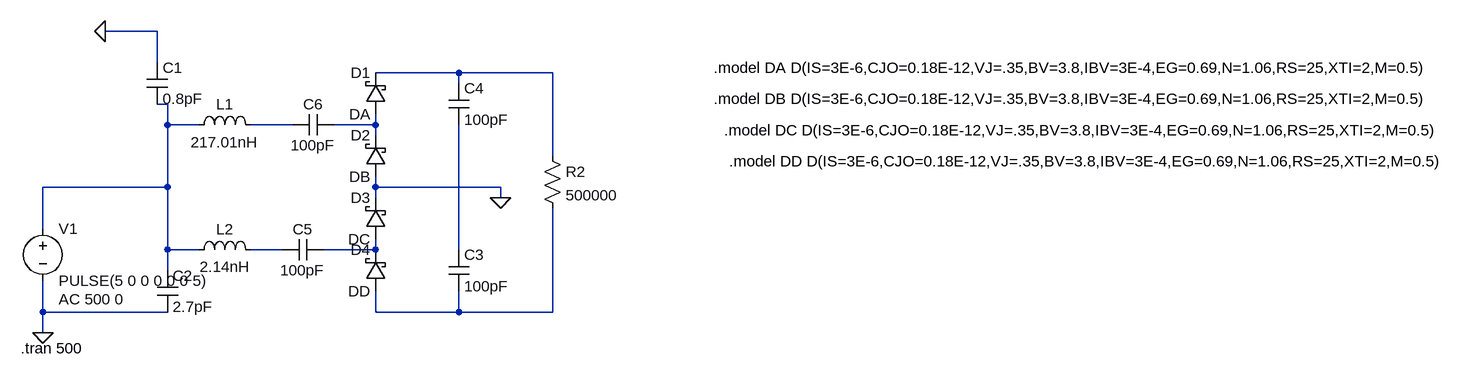
[diagram p0: schematic group 37 sim.asc]
group 37 sim.asc, the LTspice schematic file:
Version 4
SHEET 1 2120 680
WIRE -16 -32 -96 -32
WIRE -16 16 -16 -32
WIRE 448 32 320 32
WIRE 592 32 448 32
WIRE 448 48 448 32
WIRE 0 80 -16 80
WIRE 0 112 0 80
WIRE 48 112 0 112
WIRE 192 112 128 112
WIRE 320 112 320 96
WIRE 320 112 256 112
WIRE 320 128 320 112
WIRE 592 160 592 32
WIRE 0 208 0 112
WIRE 0 208 -192 208
WIRE 320 208 320 192
WIRE 512 208 320 208
WIRE 320 224 320 208
WIRE 512 224 512 208
WIRE -192 272 -192 208
WIRE 0 304 0 208
WIRE 48 304 0 304
WIRE 176 304 128 304
WIRE 320 304 320 288
WIRE 320 304 240 304
WIRE 448 304 448 112
WIRE 0 336 0 304
WIRE -192 400 -192 352
WIRE 0 400 -192 400
WIRE 320 400 320 368
WIRE 448 400 448 368
WIRE 448 400 320 400
WIRE 592 400 592 240
WIRE 592 400 448 400
WIRE -192 432 -192 400
FLAG -192 432 0
FLAG -96 -32 0
FLAG 512 224 0
SYMBOL cap -32 16 R0
SYMATTR InstName C1
SYMATTR Value 0.8pF
SYMBOL cap -16 336 R0
SYMATTR InstName C2
SYMATTR Value 2.7pF
SYMBOL cap 432 304 R0
SYMATTR InstName C3
SYMATTR Value 100pF
SYMBOL cap 432 48 R0
SYMATTR InstName C4
SYMATTR Value 100pF
SYMBOL cap 240 288 R90
WINDOW 0 0 32 VBottom 2
WINDOW 3 32 32 VTop 2
SYMATTR InstName C5
SYMATTR Value 100pF
SYMBOL cap 256 96 R90
WINDOW 0 0 32 VBottom 2
WINDOW 3 32 32 VTop 2
SYMATTR InstName C6
SYMATTR Value 100pF
SYMBOL ind 32 128 R270
WINDOW 0 32 56 VTop 2
WINDOW 3 5 56 VBottom 2
SYMATTR InstName L1
SYMATTR Value 217.01nH
SYMBOL ind 32 320 R270
WINDOW 0 32 56 VTop 2
WINDOW 3 5 56 VBottom 2
SYMATTR InstName L2
SYMATTR Value 2.14nH
SYMBOL res 576 144 R0
SYMATTR InstName R2
SYMATTR Value 500000
SYMBOL schottky 336 96 R180
WINDOW 0 24 64 Left 2
WINDOW 3 24 0 Left 2
SYMATTR InstName D1
SYMATTR Value DA
SYMBOL schottky 336 192 R180
WINDOW 0 24 64 Left 2
WINDOW 3 24 0 Left 2
SYMATTR InstName D2
SYMATTR Value DB
SYMBOL schottky 336 288 R180
WINDOW 0 24 64 Left 2
WINDOW 3 24 0 Left 2
SYMATTR InstName D3
SYMATTR Value DC
SYMBOL schottky 336 368 R180
WINDOW 0 24 64 Left 2
WINDOW 3 24 0 Left 2
SYMATTR InstName D4
SYMATTR Value DD
SYMBOL voltage -192 256 R0
WINDOW 123 24 124 Left 2
WINDOW 39 0 0 Left 2
SYMATTR InstName V1
SYMATTR Value PULSE(5 0 0 0 0 0 5)
SYMATTR Value2 AC 500 0
TEXT 840 24 Left 2 !.model DA D(IS=3E-6,CJO=0.18E-12,VJ=.35,BV=3.8,IBV=3E-4,EG=0.69,N=1.06,RS=25,XTI=2,M=0.5)
TEXT 840 72 Left 2 !.model DB D(IS=3E-6,CJO=0.18E-12,VJ=.35,BV=3.8,IBV=3E-4,EG=0.69,N=1.06,RS=25,XTI=2,M=0.5)
TEXT 856 120 Left 2 !.model DC D(IS=3E-6,CJO=0.18E-12,VJ=.35,BV=3.8,IBV=3E-4,EG=0.69,N=1.06,RS=25,XTI=2,M=0.5)
TEXT 864 168 Left 2 !.model DD D(IS=3E-6,CJO=0.18E-12,VJ=.35,BV=3.8,IBV=3E-4,EG=0.69,N=1.06,RS=25,XTI=2,M=0.5)
TEXT -226 456 Left 2 !.tran 500

The netlist it stands for:
* group 37 sim.asc
C1 0 N002 0.8pF
C2 N002 0 2.7pF
C3 N007 N008 100pF
C4 N001 N007 100pF
C5 N006 N005 100pF
C6 N004 N003 100pF
L1 N002 N003 217.01nH
L2 N002 N005 2.14nH
R2 N001 N008 500000
D1 N004 N001 DA
D2 0 N004 DB
D3 N006 0 DC
D4 N008 N006 DD
V1 N002 0 PULSE(5 0 0 0 0 0 5) AC 500 0
.model D D
.lib standard.dio
.model DA D(IS=3E-6,CJO=0.18E-12,VJ=.35,BV=3.8,IBV=3E-4,EG=0.69,N=1.06,RS=25,XTI=2,M=0.5)
.model DB D(IS=3E-6,CJO=0.18E-12,VJ=.35,BV=3.8,IBV=3E-4,EG=0.69,N=1.06,RS=25,XTI=2,M=0.5)
.model DC D(IS=3E-6,CJO=0.18E-12,VJ=.35,BV=3.8,IBV=3E-4,EG=0.69,N=1.06,RS=25,XTI=2,M=0.5)
.model DD D(IS=3E-6,CJO=0.18E-12,VJ=.35,BV=3.8,IBV=3E-4,EG=0.69,N=1.06,RS=25,XTI=2,M=0.5)
.tran 500
.backanno
.end